# EasyEDA schematic PCB_SIT210.json
TITLE: New Schematic; REV: 1.0; Date: 2020-06-05; Sheet: 1/1; Drawn By: guri8751
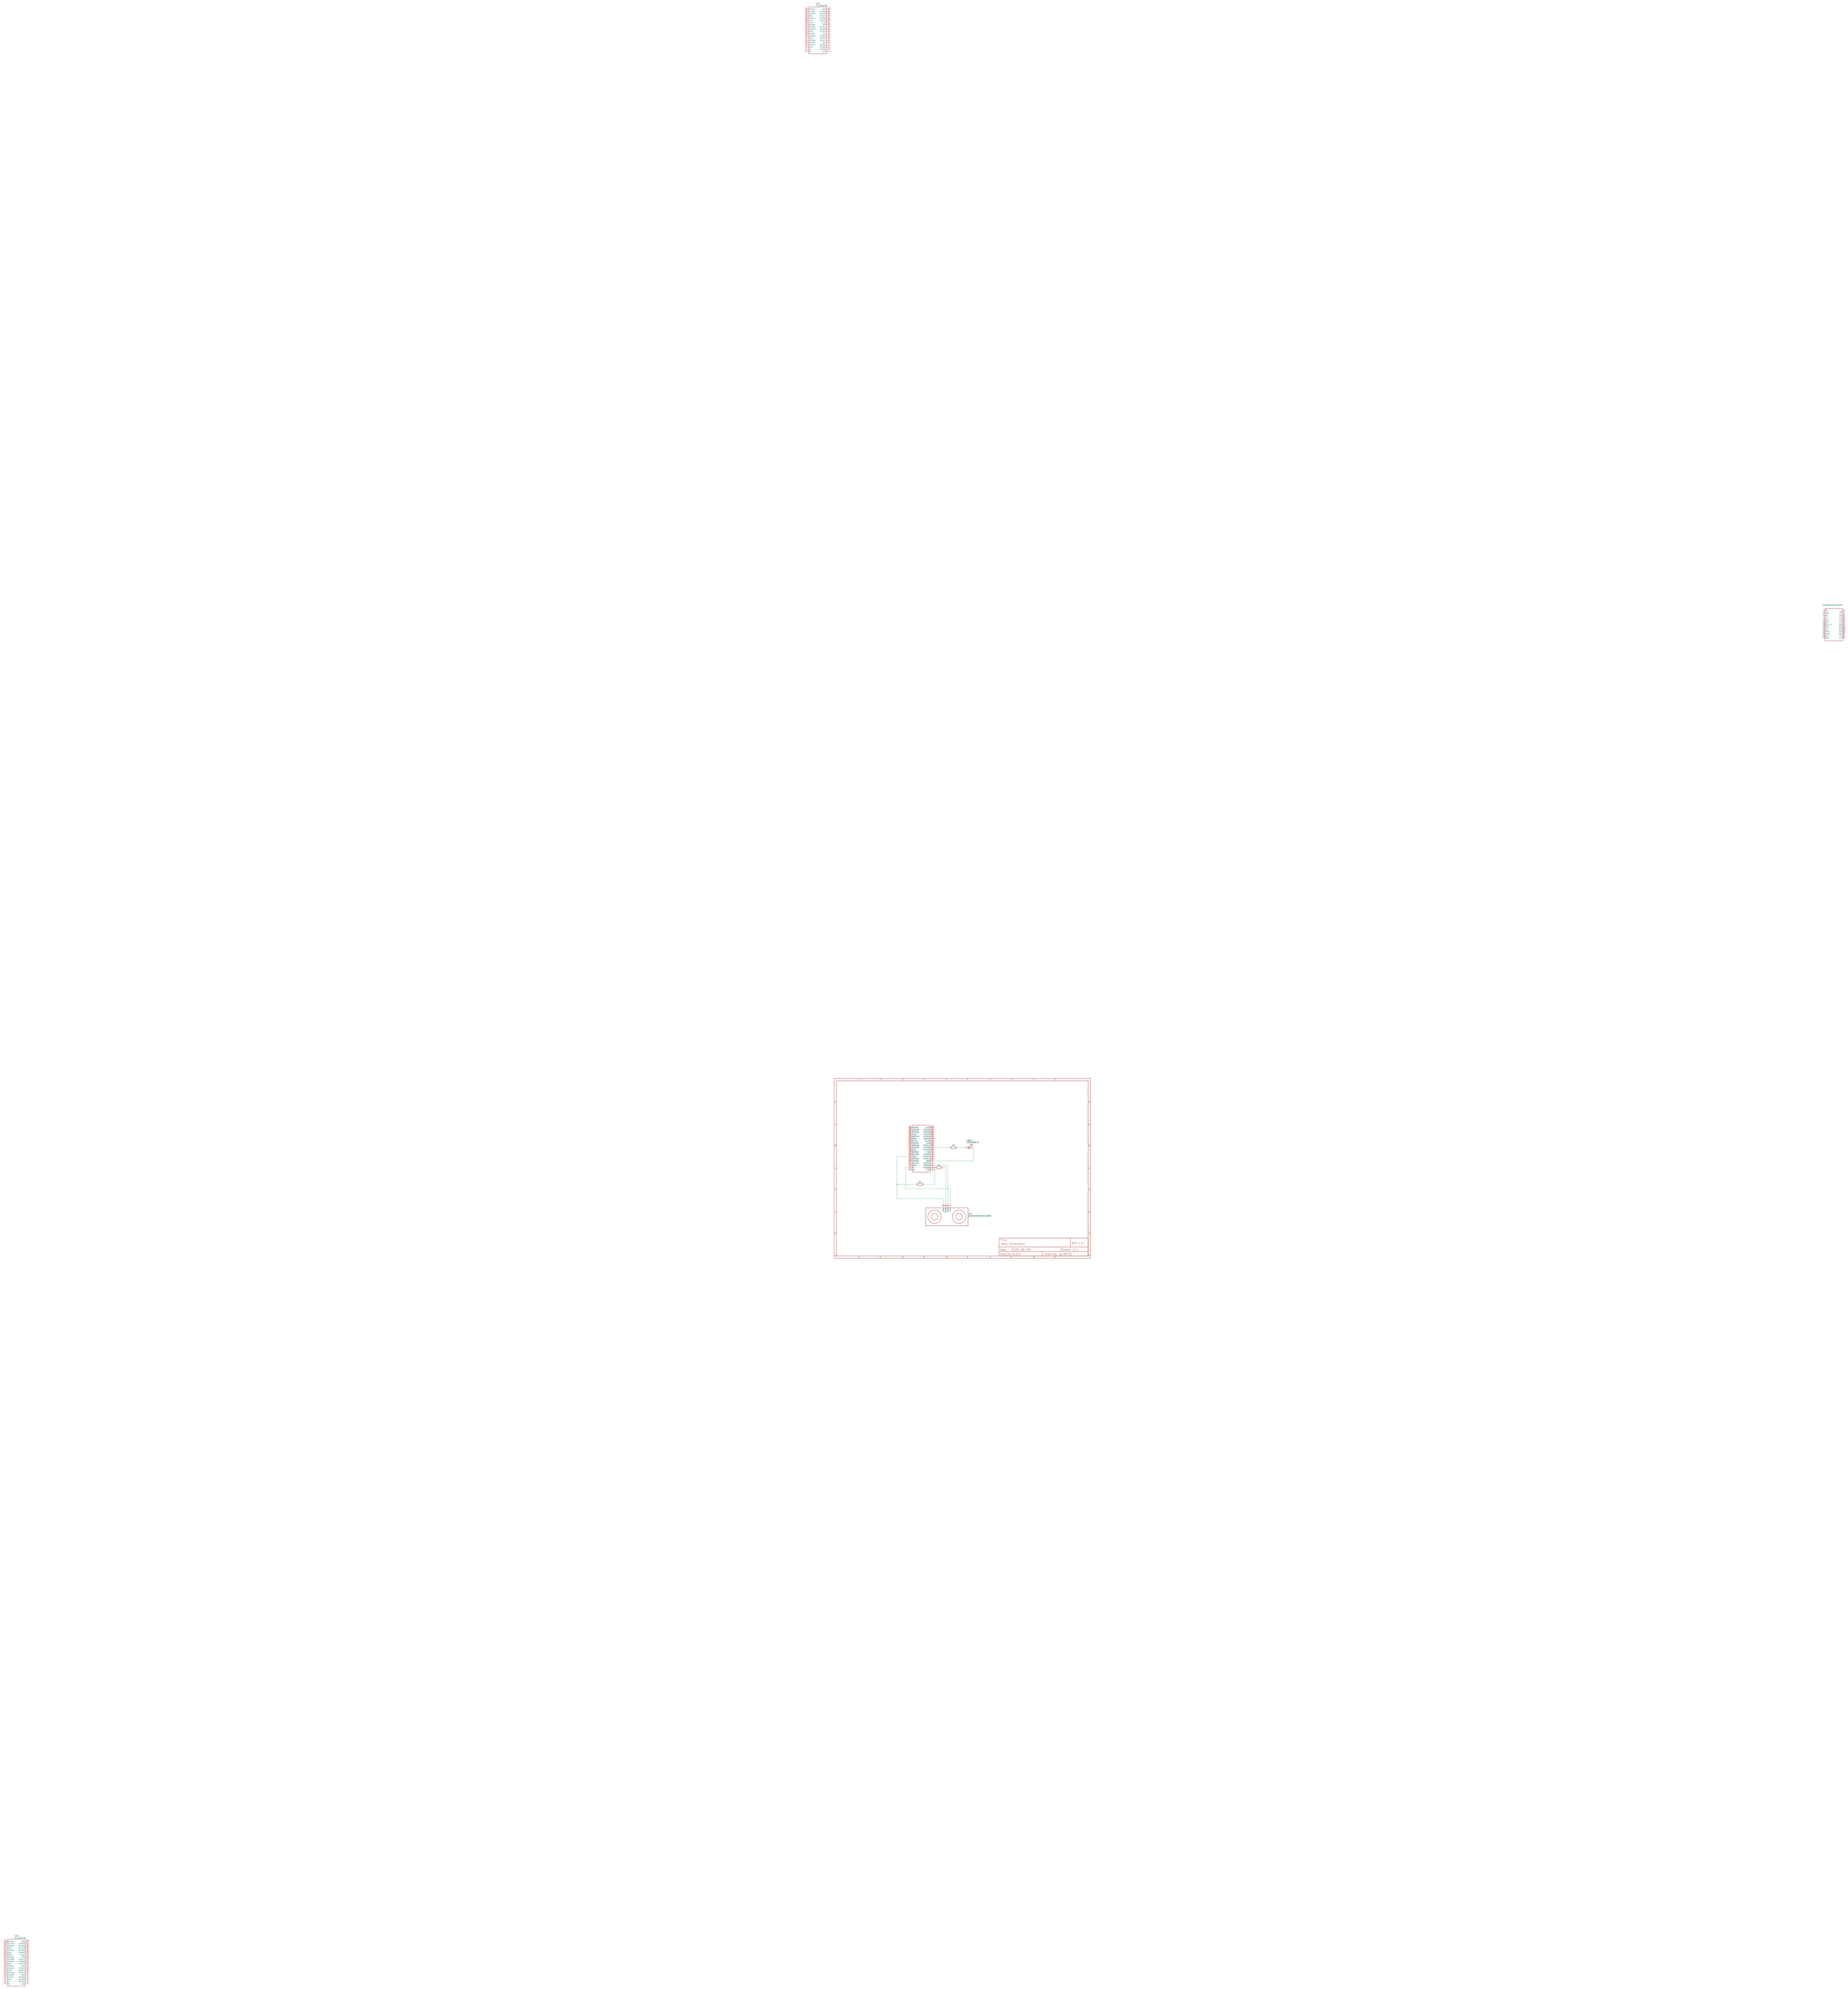
[diagram p0: schematic sheet]

## Parts
LED1  LED-0603_R  [LED0603_RED]
R4  1k  [R0201]
R5  1k  [R0201]
R6  1k  [R0201]
RASPBERRYPIGPIO  Raspberry Pi
U1  Pi connector  [PI CONNECTOR]
U5  ULTRASONIC-HC-SR04  [ULTRASONIC-HC-SR04]
U23  Pi connector  [PI CONNECTOR]
U24  Pi connector  [PI CONNECTOR]

## Library data of the parts
LED1 = LED-0603_R: Manufacturer: EVERLIGHT(台湾亿光); Manufacturer Part: 19-217/R6C-AL1M2VY/3T; Supplier Part: C72044; Supplier: LCSC; Contributor: LCEDA_01
R4-R6 = R_0201_EU: Contributor: LCEDA_Lib
RASPBERRYPIGPIO = -: Manufacturer Part: ?
U1 U23 U24 = -: Contributor: jjvan; sourceId: ylVTRcawS; Manufacturer Part: ?
U5 = -: Ultrasonic Ranging Module HC-SR04; catid: 20; sourceId: iECXHFpLv; Manufacturer Part: ?; Supplier: RS-Online

## Nets
Net-(LED1-1): LED1.1 R6.2
Net-(LED1-2): LED1.2 U1.9(GND)
Net-(R4-1): R4.1 R5.2 U1.1(3.3v) U1.3(GPIO02)
Net-(R4-2): R4.2 U5.3(ECHO)
Net-(R5-1): R5.1 U1.14(GND) U5.4(GND)
Net-(R6-1): R6.1 U1.21(GPIO09)
Net-(U1-4): U1.4(5v) U5.1(VCC)
Net-(U1-5): U1.5(GPIO03) U5.2(TRIG)

Not connected (* = marked no-connect by the designer): RASPBERRYPIGPIO 1(3v3) 2(5v0) 3(SDA) 4(5v0) 5(GND) 6(GND) 7(#4) 8(TXD) 10(RXD) 11(#17) 12(#18) 13(#21/27) 14(GND) 15(#22) 16(#23) 17(3v3) 18(#24) 19(MOSI) 20(GND) 21(MISO) 22(#25) 23(SCLK) 24(CE0) 25(GND) 26(CE1); U1 2(5v) 6(GND) 7(GPIO04) 8(GPIO14) 10(GPIO15) 11(GPIO17) 12(GPIO18) 13(GPIO27) 15(GPIO22) 16(GPIO23) 17(3.3v) 18(GPIO24) 19(GPIO10) 20(GND) 22(GPIO25) 23(GPIO11) 24(GPIO08) 25(GND) 26(GPIO07) 27(ID_SD) 28(ID_SC) 29(GPIO05) 30(GND) 31(GPIO06) 32(GPIO12) 33(GPIO13) 34(GND) 35(GPIO19) 36(GPIO16) 37(GPIO26) 38(GPIO20) 39(GND) 40(GPIO21); U23 1(3.3v) 2(5v) 3(GPIO02) 4(5v) 5(GPIO03) 6(GND) 7(GPIO04) 8(GPIO14) 9(GND) 10(GPIO15) 11(GPIO17) 12(GPIO18) 13(GPIO27) 14(GND) 15(GPIO22) 16(GPIO23) 17(3.3v) 18(GPIO24) 19(GPIO10) 20(GND) 21(GPIO09) 22(GPIO25) 23(GPIO11) 24(GPIO08) 25(GND) 26(GPIO07) 27(ID_SD) 28(ID_SC) 29(GPIO05) 30(GND) 31(GPIO06) 32(GPIO12) 33(GPIO13) 34(GND) 35(GPIO19) 36(GPIO16) 37(GPIO26) 38(GPIO20) 39(GND) 40(GPIO21); U24 1(3.3v) 2(5v) 3(GPIO02) 4(5v) 5(GPIO03) 6(GND) 7(GPIO04) 8(GPIO14) 9(GND) 10(GPIO15) 11(GPIO17) 12(GPIO18) 13(GPIO27) 14(GND) 15(GPIO22) 16(GPIO23) 17(3.3v) 18(GPIO24) 19(GPIO10) 20(GND) 21(GPIO09) 22(GPIO25) 23(GPIO11) 24(GPIO08) 25(GND) 26(GPIO07) 27(ID_SD) 28(ID_SC) 29(GPIO05) 30(GND) 31(GPIO06) 32(GPIO12) 33(GPIO13) 34(GND) 35(GPIO19) 36(GPIO16) 37(GPIO26) 38(GPIO20) 39(GND) 40(GPIO21)
